# Altium schematic sheet GD_Tcontroller_Front.SchDoc
size A4
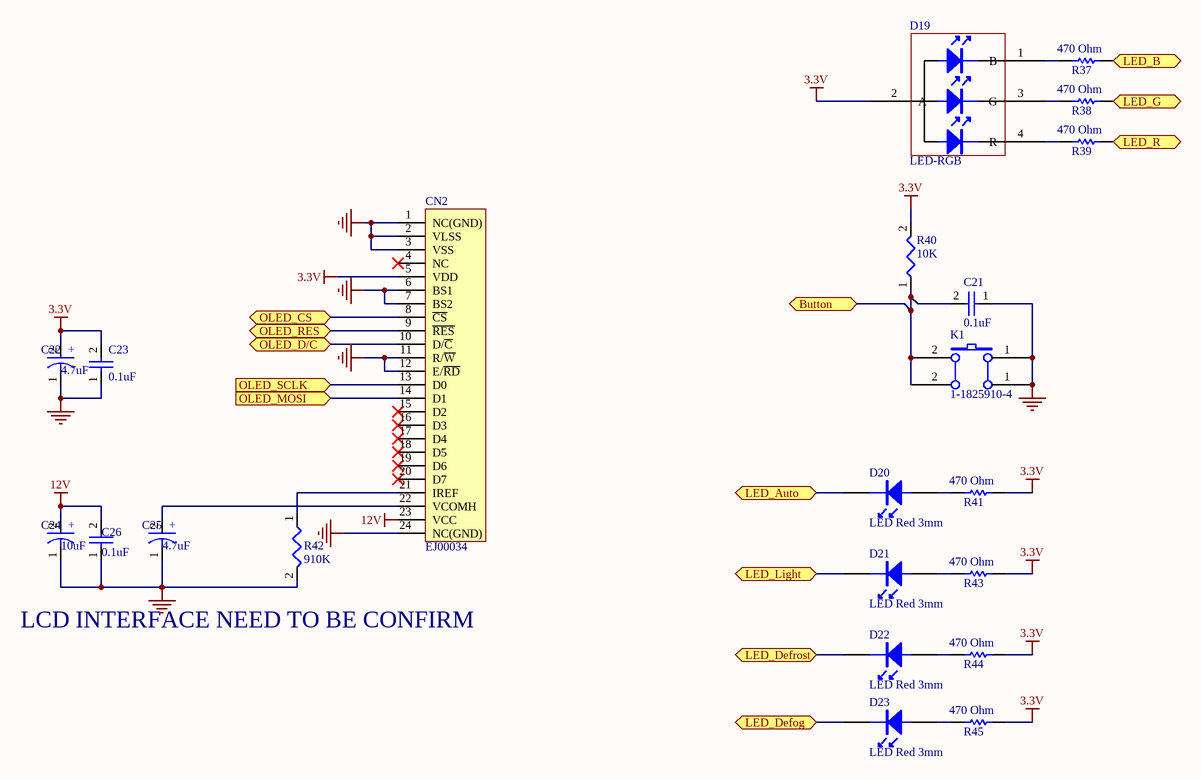
[diagram p0: GD_Tcontroller_Front.SchDoc]

## Parts
C21  value 0.1uF  [C0805]  (hidden comment: CAP)
C22  value 4.7uF  [TAN3216]  (hidden comment: CAPACITOR)
C23  value 0.1uF  [C0805]  (hidden comment: CAP)
C24  value 10uF  [TAN6032]  (hidden comment: CAPACITOR)
C25  value 4.7uF  [TAN6032]  (hidden comment: CAPACITOR)
C26  value 0.1uF  [C0805]  (hidden comment: CAP)
CN2  EJ00034  [FPC24P0_5]
D19  LED-RGB  [LED-RGB-3528]
D20  LED Red 3mm  [LED_DIP]
D21  LED Red 3mm  [LED_DIP]
D22  LED Red 3mm  [LED_DIP]
D23  LED Red 3mm  [LED_DIP]
K1  value 1-1825910-4  [AN6_3P6_5]  (hidden comment: SW PUSHBUTTON)
R37  value 470 Ohm  [R0805]  (hidden comment: 470 Ohm 5% 0805)
R38  value 470 Ohm  [R0805]  (hidden comment: 470 Ohm 5% 0805)
R39  value 470 Ohm  [R0805]  (hidden comment: 470 Ohm 5% 0805)
R40  value 10K  [R0805]  (hidden comment: RES)
R41  value 470 Ohm  [R0805]  (hidden comment: 470 Ohm 5% 0805)
R42  value 910K  [R0805]  (hidden comment: RES)
R43  value 470 Ohm  [R0805]  (hidden comment: 470 Ohm 5% 0805)
R44  value 470 Ohm  [R0805]  (hidden comment: 470 Ohm 5% 0805)
R45  value 470 Ohm  [R0805]  (hidden comment: 470 Ohm 5% 0805)

## Ports
Button, LED_Auto, LED_B, LED_Defog, LED_Defrost, LED_G, LED_Light, LED_R, OLED_CS (bidir), OLED_D/C (bidir), OLED_MOSI (in), OLED_RES (bidir), OLED_SCLK (in)

## Nets
3.3V: C22.2 C23.2 CN2.5(VDD) D19.2(A) R40.2 R41.2 R43.2 R44.2 R45.2
12V: C24.2 C26.2 CN2.23(VCC)
GND: C21.1 C22.1 C23.1 C24.1 C25.1 C26.1 CN2.1(NC(GND)) CN2.2(VLSS) CN2.3(VSS) CN2.6(BS1) CN2.7(BS2) CN2.11(R/~{W}) CN2.12(E/~{RD}) CN2.24(NC(GND)) K1.1(A0) R42.2
Button: C21.2 K1.2(B0) R40.1 ; port Button
LED_Auto: D20.2 ; port LED_Auto
LED_B: R37.2 ; port LED_B
LED_Defog: D23.2 ; port LED_Defog
LED_Defrost: D22.2 ; port LED_Defrost
LED_G: R38.2 ; port LED_G
LED_Light: D21.2 ; port LED_Light
LED_R: R39.2 ; port LED_R
OLED_CS: CN2.8(~{CS}) ; port OLED_CS
OLED_D/C: CN2.10(D/~{C}) ; port OLED_D/C
OLED_MOSI: CN2.14(D1) ; port OLED_MOSI
OLED_RES: CN2.9(~{RES}) ; port OLED_RES
OLED_SCLK: CN2.13(D0) ; port OLED_SCLK
NetC25_2: C25.2 CN2.22(VCOMH)
NetCN2_21: CN2.21(IREF) R42.1
NetD19_1: D19.1(B) R37.1
NetD19_3: D19.3(G) R38.1
NetD19_4: D19.4(R) R39.1
NetD20_1: D20.1 R41.1
NetD21_1: D21.1 R43.1
NetD22_1: D22.1 R44.1
NetD23_1: D23.1 R45.1

Not connected (* = marked no-connect by the designer): CN2 4(NC)* 15(D2)* 16(D3)* 17(D4)* 18(D5)* 19(D6)* 20(D7)*

## Notes on the sheet
- LCD INTERFACE NEED TO BE CONFIRM
- (in symbol EC00035) +
- (in symbol EC00040) +

## Library data of the parts
C21 C23 C26 = EC00014: CAP SMD CR X7R 50V 10% 0.1uF 0805 ROHS; Manufacturer: YAGEO; Manufacturer P/N: CC0805KRX7R9BB104; ID: 14; HelpURL: *; P/N: EC00014
C22 = EC00035: TAN 10uF 20% 10V 3216; Manufacturer: AVX; Manufacturer P/N: TAJE106K050RNJ; ID: 35; Type: ****; HelpURL: \\192.168.1.3\Esh\Department\RD\CAD\Component\Capacitor\smd\AVX_tps.PDF; P/N: EC00035
C24 = EC00035: CAP SMD Tan 35V 10% 10uF 2917 ROHS; Manufacturer: AVX; Manufacturer P/N: TAJE106K050RNJ; ID: 35; Type: ****; HelpURL: \\192.168.1.3\Esh\Department\RD\CAD\Component\Capacitor\smd\AVX_tps.PDF; P/N: EC00035
C25 = EC00040: CAP SMD Tan 35V 10% 4.7uF 2312 ROHS; Manufacturer: AVX; Manufacturer P/N: TPSC475K035#0600; ID: 40; Type: ****; HelpURL: \\192.168.1.3\Esh\Department\RD\CAD\Component\Capacitor\smd\AVX_tps.PDF; P/N: EC00040
CN2 = EJ00034: CONNECTOR FPC0.5MM 24PIN,0.4A,50V,SMT; Manufacturer P/N: SFV24R-1STE1HLF; Manufacturer: FCI; ID: 34; Value: SFV24R-1STE1HLF; HelpURL: \\192.168.1.3\Esh\Department\RD\CAD\Component\connector\FPC\SFV24R-2STE1HLF.pdf; P/N: EJ00034; Type: *****
D20-D23 = LED
K1 = ES00003: Button ON/OFF，6.3X6.3X9.5MM,DIP-2; Manufacturer: Tyco Electronics; ID: 3; HelpURL: \\192.168.1.3\Esh\Department\RD\CAD\Component\button\ENG_CD_1825910_C6[1].pdf; P/N: ES00003; Manufacturer P/N: 1-1825910-4; Type: *****
R37-R39 R41 R43-R45 = CMP-1013-00098-1: 470Ohm 0.125W 5% 0805 (2012 Metric)  SMD; Case-EIA: 0805; Case-Metric: 2012; Power: 0.125 W; Technology: SMT; Tolerance: 5 %
R40 = ER00031: RES THICK_FILM SMD 10K 5% 1/8W ROHS 0805; Manufacturer: YAGEO; Manufacturer P/N: RC0805JR-0710KL; ID: 31; HelpURL: *; P/N: ER00031
R42 = ER00075: RES 	THICK_FILM SMD 910K 1%	 1/8W 	ROHS 	0805; Manufacturer: YAGEO; Manufacturer P/N: RC0805FR-07910KL; ID: 75; HelpURL: *; P/N: ER00075